# EAGLE design WorldClock (EAGLE 9.3.1)
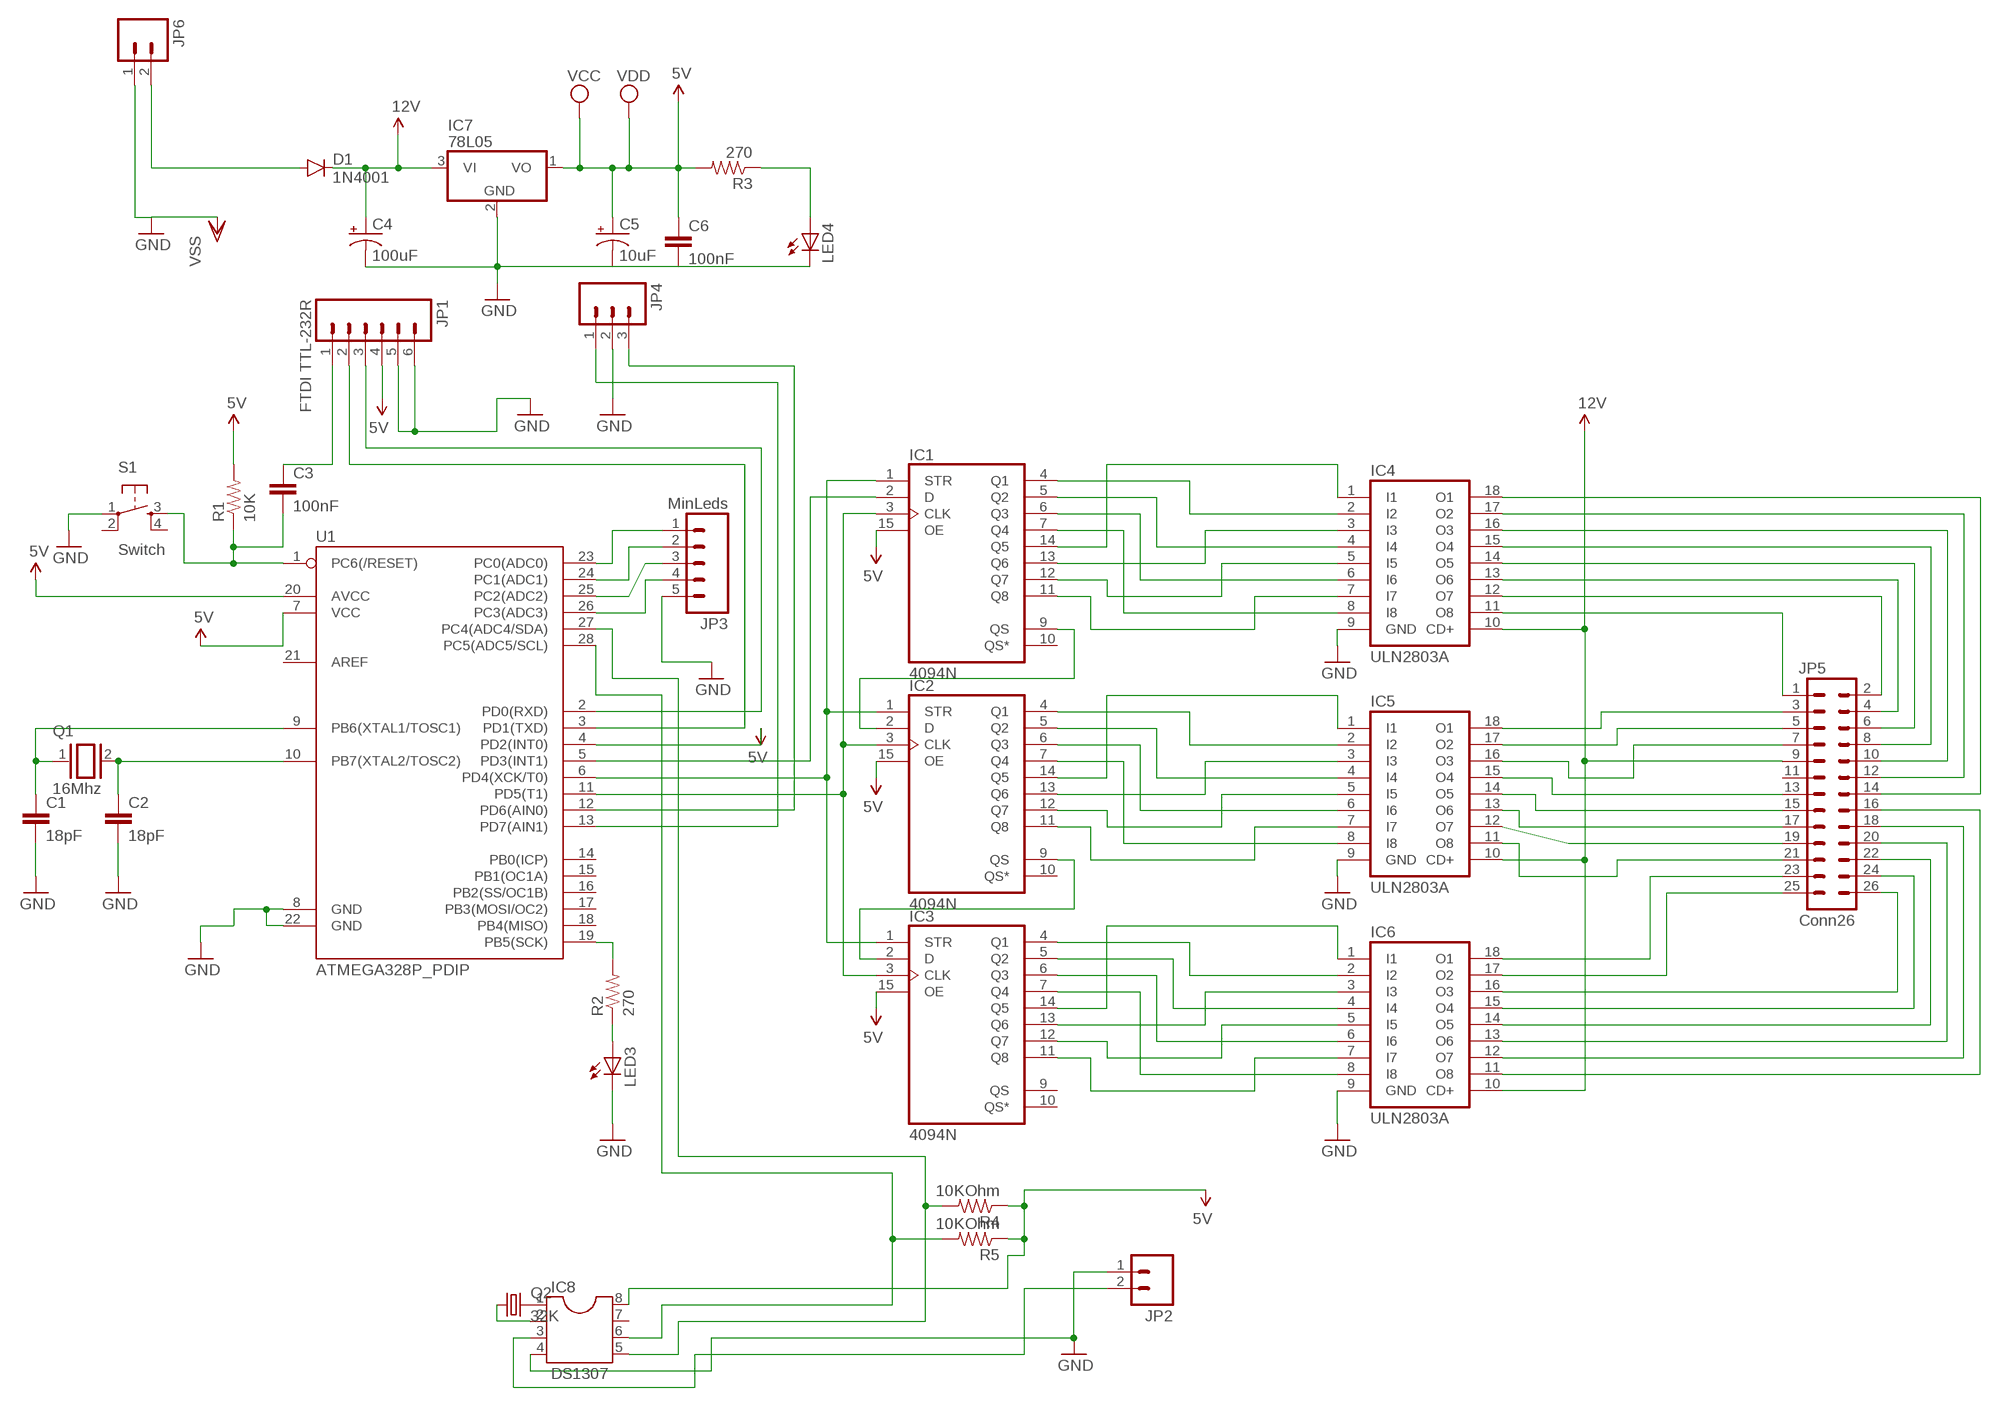
[diagram p0: schematic, sheet 1]

## Parts
C1  18pF  CAPPTH2  [CAP-PTH-SMALL2]
C2  18pF  CAPPTH2  [CAP-PTH-SMALL2]
C3  100nF  CAPPTH2  [CAP-PTH-SMALL2]
C4  100uF  CAP_POLPTH1  [CPOL-RADIAL-100UF-25V]
C5  10uF  CAP_POLPTH2  [CPOL-RADIAL-10UF-25V]
C6  100nF  CAPPTH2  [CAP-PTH-SMALL2]
D1  1N4001  DIODE1N4148  [DIODE-1N4148]
IC1  4094N  [DIL16]
IC2  4094N  [DIL16]
IC3  4094N  [DIL16]
IC4  ULN2803A  [DIL18]
IC5  ULN2803A  [DIL18]
IC6  ULN2803A  [DIL18]
IC7  78L05  78L12Z  [TO92]
IC8  DS1307  DIL8S  [SOCKET-08]
JP1  FTDI TTL-232R  M06NO_SILK_FEMALE_PTH  [1X06_NO_SILK]
JP2  M025MM  [SCREWTERMINAL-5MM-2]
JP3  MinLeds  M05PTH  [1X05]
JP4  M03-SCREW-5MM  [SCREWTERMINAL-5MM-3]
JP5  Conn26  M13X22X13  [2X13]
JP6  M025MM  [SCREWTERMINAL-5MM-2]
LED3  LED5MM  [LED5MM]
LED4  LED5MM  [LED5MM]
Q1  16Mhz  XTAL/S  [QS]
Q2  32K  CRYSTALTC26V  [TC26V]
R1  10K  RESISTORPTH-1/4W  [AXIAL-0.4]
R2  270  RESISTORPTH-1/4W  [AXIAL-0.4]
R3  270  RESISTORPTH-1/4W  [AXIAL-0.4]
R4  10KOhm  RESISTORPTH-1/4W  [AXIAL-0.4]
R5  10KOhm  RESISTORPTH-1/4W  [AXIAL-0.4]
S1  Switch  TAC_SWITCHPTH  [TACTILE-PTH]
U1  ATMEGA328P_PDIP  [DIL28-3]

## Nets
5V: C5.1(+) C6.1 IC1.15(OE) IC2.15(OE) IC3.15(OE) IC7.1(VO) IC8.8 JP1.4 R1.P$2 R3.P$2 R4.P$1 R5.P$1 U1.4(PD2(INT0)) U1.7(VCC) U1.20(AVCC) ; supply symbol labelled VCC, VDD
12V: C4.1(+) D1.C IC4.10(CD+) IC5.10(CD+) IC6.10(CD+) IC7.3(VI) JP5.9
GND: C1.2 C2.2 C4.2(-) C5.2(-) C6.2 IC4.9(GND) IC5.9(GND) IC6.9(GND) IC7.2(GND) IC8.4 JP1.5 JP1.6 JP2.1 JP3.5 JP4.2 JP6.1 LED3.K(C) LED4.K(C) S1.1 U1.8(GND) U1.22(GND) ; supply symbol labelled VSS
N$1: C1.1 Q1.1 U1.9(PB6(XTAL1/TOSC1))
N$2: C2.1 Q1.2 U1.10(PB7(XTAL2/TOSC2))
N$3: C3.2 R1.P$1 S1.3 U1.1(PC6(/RESET))
N$4: C3.1 JP1.1
N$5: JP4.1 U1.13(PD7(AIN1))
N$6: JP1.2 U1.3(PD1(TXD))
N$7: JP1.3 U1.2(PD0(RXD))
N$8: JP4.3 U1.12(PD6(AIN0))
N$9: JP3.1 U1.23(PC0(ADC0))
N$10: JP3.2 U1.24(PC1(ADC1))
N$11: JP3.3 U1.25(PC2(ADC2))
N$12: JP3.4 U1.26(PC3(ADC3))
N$13: R2.P$2 U1.19(PB5(SCK))
N$14: LED3.A R2.P$1
N$15: IC1.4(Q1) IC4.2(I2)
N$16: IC1.5(Q2) IC4.4(I4)
N$17: IC1.6(Q3) IC4.6(I6)
N$18: IC1.7(Q4) IC4.8(I8)
N$19: IC1.14(Q5) IC4.1(I1)
N$20: IC1.13(Q6) IC4.3(I3)
N$21: IC1.12(Q7) IC4.5(I5)
N$22: IC1.11(Q8) IC4.7(I7)
N$23: IC1.9(QS) IC2.2(D)
N$24: IC2.4(Q1) IC5.2(I2)
N$25: IC2.5(Q2) IC5.4(I4)
N$26: IC2.6(Q3) IC5.6(I6)
N$27: IC2.7(Q4) IC5.8(I8)
N$28: IC2.14(Q5) IC5.1(I1)
N$29: IC2.13(Q6) IC5.3(I3)
N$30: IC2.12(Q7) IC5.5(I5)
N$31: IC2.11(Q8) IC5.7(I7)
N$32: IC2.9(QS) IC3.2(D)
N$33: IC3.4(Q1) IC6.2(I2)
N$34: IC3.5(Q2) IC6.4(I4)
N$35: IC3.6(Q3) IC6.6(I6)
N$36: IC3.7(Q4) IC6.8(I8)
N$37: IC3.14(Q5) IC6.1(I1)
N$38: IC3.13(Q6) IC6.3(I3)
N$39: IC3.12(Q7) IC6.5(I5)
N$40: IC3.11(Q8) IC6.7(I7)
N$41: IC1.2(D) U1.5(PD3(INT1))
N$42: IC1.1(STR) IC2.1(STR) IC3.1(STR) U1.6(PD4(XCK/T0))
N$43: IC1.3(CLK) IC2.3(CLK) IC3.3(CLK) U1.11(PD5(T1))
N$44: IC5.14(O5) JP5.15
N$45: LED4.A R3.P$1
N$46: IC5.13(O6) JP5.17
N$47: IC4.11(O8) JP5.1
N$48: D1.A JP6.2
N$49: IC4.12(O7) JP5.2
N$50: IC4.13(O6) JP5.4
N$51: IC4.14(O5) JP5.6
N$52: IC4.15(O4) JP5.8
N$53: IC4.16(O3) JP5.10
N$54: IC4.17(O2) JP5.12
N$55: IC4.18(O1) JP5.14
N$56: IC5.18(O1) JP5.3
N$57: IC5.17(O2) JP5.5
N$58: IC5.16(O3) JP5.7
N$59: IC5.15(O4) JP5.13
N$60: IC5.12(O7) JP5.19
N$61: IC6.18(O1) JP5.23
N$62: IC5.11(O8) JP5.21
N$63: IC6.17(O2) JP5.25
N$64: IC6.16(O3) JP5.26
N$65: IC6.15(O4) JP5.24
N$66: IC6.14(O5) JP5.22
N$67: IC6.13(O6) JP5.20
N$68: IC6.12(O7) JP5.18
N$69: IC6.11(O8) JP5.16
N$70: IC8.6 R5.P$2 U1.28(PC5(ADC5/SCL))
N$71: IC8.3 JP2.2
N$72: IC8.5 R4.P$2 U1.27(PC4(ADC4/SDA))
N$73: IC8.1 Q2.2
N$74: IC8.2 Q2.1
Unconnected: IC1.10(QS*) IC2.10(QS*) IC3.9(QS) IC3.10(QS*) IC8.7 JP5.11 S1.2 S1.4 U1.14(PB0(ICP)) U1.15(PB1(OC1A)) U1.16(PB2(SS/OC1B)) U1.17(PB3(MOSI/OC2)) U1.18(PB4(MISO)) U1.21(AREF)

## Power pins joined to a net without a drawn wire
5V: IC1.16(VDD) IC2.16(VDD) IC3.16(VDD)
GND: IC1.8(VSS) IC2.8(VSS) IC3.8(VSS)

## Library data of the parts
C1-C3 C6 = SparkFun-Passives:CAP: Capacitor Standard 0603 ceramic capacitor, and 0.1" leaded capacitor.
C4 C5 = SparkFun-Capacitors:CAP_POL: Capacitor Polarized These are standard SMD and PTH capacitors. Normally 10uF, 47uF, and 100uF in electrolytic and tantalum varieties. Always verify the external diameter of the through hole cap, it varies with capacity, voltage, and manufacturer. The EIA devices should be standard.
D1 = SparkFun-DiscreteSemi:DIODE: Diode These are standard reverse protection diodes and small signal diodes. SMA package can handle up to about 1A. SOD-323 can handle about 200mA. What the SOD-323 package when ordering, there are some mfgs out there that are 5-pin packages.
IC1-IC3 = 40xx:4094: 8-stage SHIFT/STORE REGISTER, tri-state
IC4-IC6 = uln-udn:ULN2803A: DRIVER ARRAY
IC7 = linear:78*: Positive VOLTAGE REGULATOR Source: http://cache.national.com/ds/LM/LM78L05.pdf http://www.fairchildsemi.com/ds/LM/LM7805.pdf
IC8 = ic-package:DIL8: Dual In Line / Socket
JP1 = SparkFun-Connectors:M06: Header 6 Standard 6-pin 0.1" header. Use with straight break away headers (SKU : PRT-00116), right angle break away headers (PRT-00553), swiss pins (PRT-00743), machine pins (PRT-00117), and female headers (PRT-00115). Molex polarized connector foot print use with SKU : PRT-08094 with associated crimp pins and housings. NOTES ON THE VARIANTS LOCK and LOCK_LONGPADS... This footprint was designed to help hold the alignment of a through-hole component (i.e. 6-pin header) while soldering it into place. You may notice that each hole has been shifted either up or down by 0.005 of an inch from it's more standard position (which is a perfectly straight line). This slight alteration caused the pins (the squares in the middle) to touch the edges of the holes. Because they are alternating, it causes a "brace" to hold the component in place. 0.005 has proven to be the perfect amount of "off-center" position when using our standard breakaway headers. Although looks a little odd when you look at the bare footprint, once you have a header in there, the alteration is very hard to notice. Also,if you push a header all the way into place, it is covered up entirely on the bottom side. This idea of altering the position of holes to aid alignment will be further integrated into the Sparkfun Library for other footprints. It can help hold any component with 3 or more connection pins.; PROD_ID: CONN-08437
JP2 JP6 = SparkFun-Connectors:M02: Standard 2-pin 0.1" header. Use with - straight break away headers ( PRT-00116) - right angle break away headers (PRT-00553) - swiss pins (PRT-00743) - machine pins (PRT-00117) - female headers (PRT-00115) Molex polarized connector foot print use with: PRT-08233 with associated crimp pins and housings. 2.54_SCREWTERM for use with PRT-10571. 3.5mm Screw Terminal footprints for PRT-08084 5mm Screw Terminal footprints for use with PRT-08432; STOREFRONT_ID: PRT-08432
JP3 = SparkFun-Connectors:M05: Header 5 Standard 5-pin 0.1" header. Use with straight break away headers (SKU : PRT-00116), right angle break away headers (PRT-00553), swiss pins (PRT-00743), machine pins (PRT-00117), and female headers (PRT-00115). Molex polarized connector foot print use with SKU : PRT-08230 with associated crimp pins and housings.
JP4 = SparkFun-Connectors:M03: Header 3 Standard 3-pin 0.1" header. Use with straight break away headers (SKU : PRT-00116), right angle break away headers (PRT-00553), swiss pins (PRT-00743), machine pins (PRT-00117), and female headers (PRT-00115). Molex polarized connector foot print use with SKU : PRT-08232 with associated crimp pins and housings.; STOREFRONT_ID: PRT-08433
JP5 = SparkFun-Connectors:M13X2: 0.1" spaced headers
LED3 LED4 = led:LED: LED OSRAM: - CHIPLED LG R971, LG N971, LY N971, LG Q971, LY Q971, LO R971, LY R971 LH N974, LH R974 LS Q976, LO Q976, LY Q976 LO Q996 - Hyper CHIPLED LW Q18S LB Q993, LB Q99A, LB R99A - SideLED LS A670, LO A670, LY A670, LG A670, LP A670 LB A673, LV A673, LT A673, LW A673 LH A674 LY A675 LS A676, LA A676, LO A676, LY A676, LW A676 LS A679, LY A679, LG A679 - Hyper Micro SIDELED® LS Y876, LA Y876, LO Y876, LY Y876 LT Y87S - SmartLED LW L88C, LW L88S LB L89C, LB L89S, LG L890 LS L89K, LO L89K, LY L89K LS L896, LA L896, LO L896, LY L896 - TOPLED LS T670, LO T670, LY T670, LG T670, LP T670 LSG T670, LSP T670, LSY T670, LOP T670, LYG T670 LG T671, LOG T671, LSG T671 LB T673, LV T673, LT T673, LW T673 LH T674 LS T676, LA T676, LO T676, LY T676, LB T676, LH T676, LSB T676, LW T676 LB T67C, LV T67C, LT T67C, LS T67K, LO T67K, LY T67K, LW E67C LS E67B, LA E67B, LO E67B, LY E67B, LB E67C, LV E67C, LT E67C LW T67C LS T679, LY T679, LG T679 LS T770, LO T770, LY T770, LG T770, LP T770 LB T773, LV T773, LT T773, LW T773 LH T774 LS E675, LA E675, LY E675, LS T675 LS T776, LA T776, LO T776, LY T776, LB T776 LHGB T686 LT T68C, LB T68C - Hyper Mini TOPLED® LB M676 - Mini TOPLED Santana® LG M470 LS M47K, LO M47K, LY M47K Source: http://www.osram.convergy.de LUXEON: - LUMILED® LXK2-PW12-R00, LXK2-PW12-S00, LXK2-PW14-U00, LXK2-PW14-V00 LXK2-PM12-R00, LXK2-PM12-S00, LXK2-PM14-U00 LXK2-PE12-Q00, LXK2-PE12-R00, LXK2-PE12-S00, LXK2-PE14-T00, LXK2-PE14-U00 LXK2-PB12-K00, LXK2-PB12-L00, LXK2-PB12-M00, LXK2-PB14-N00, LXK2-PB14-P00, LXK2-PB14-Q00 LXK2-PR12-L00, LXK2-PR12-M00, LXK2-PR14-Q00, LXK2-PR14-R00 LXK2-PD12-Q00, LXK2-PD12-R00, LXK2-PD12-S00 LXK2-PH12-R00, LXK2-PH12-S00 LXK2-PL12-P00, LXK2-PL12-Q00, LXK2-PL12-R00 Source: www.luxeon.com KINGBRIGHT: KA-3528ASYC Source: www.kingbright.com
Q1 = special:XTAL/S: CRYSTAL
Q2 = crystal:CRYSTAL: CRYSTAL; OC_FARNELL: unknown; OC_NEWARK: unknown
R1-R5 = SparkFun-Passives:RESISTOR: Resistor Basic schematic elements and footprints for 0603, 1206, and PTH resistors.
S1 = SparkFun-Retired:TAC_SWITCH: Momentary Switch Button commonly used for reset or general input. Spark Fun Electronics SKU : COM-00097 SMT- SWCH-08247
U1 = SparkFun-DigitalIC:ATMEGA328P_PDIP: uC used in the Arduino 32kb flash, 1k EEPROM, 2k SRAM This is the through-hole version of this chip.

## Board
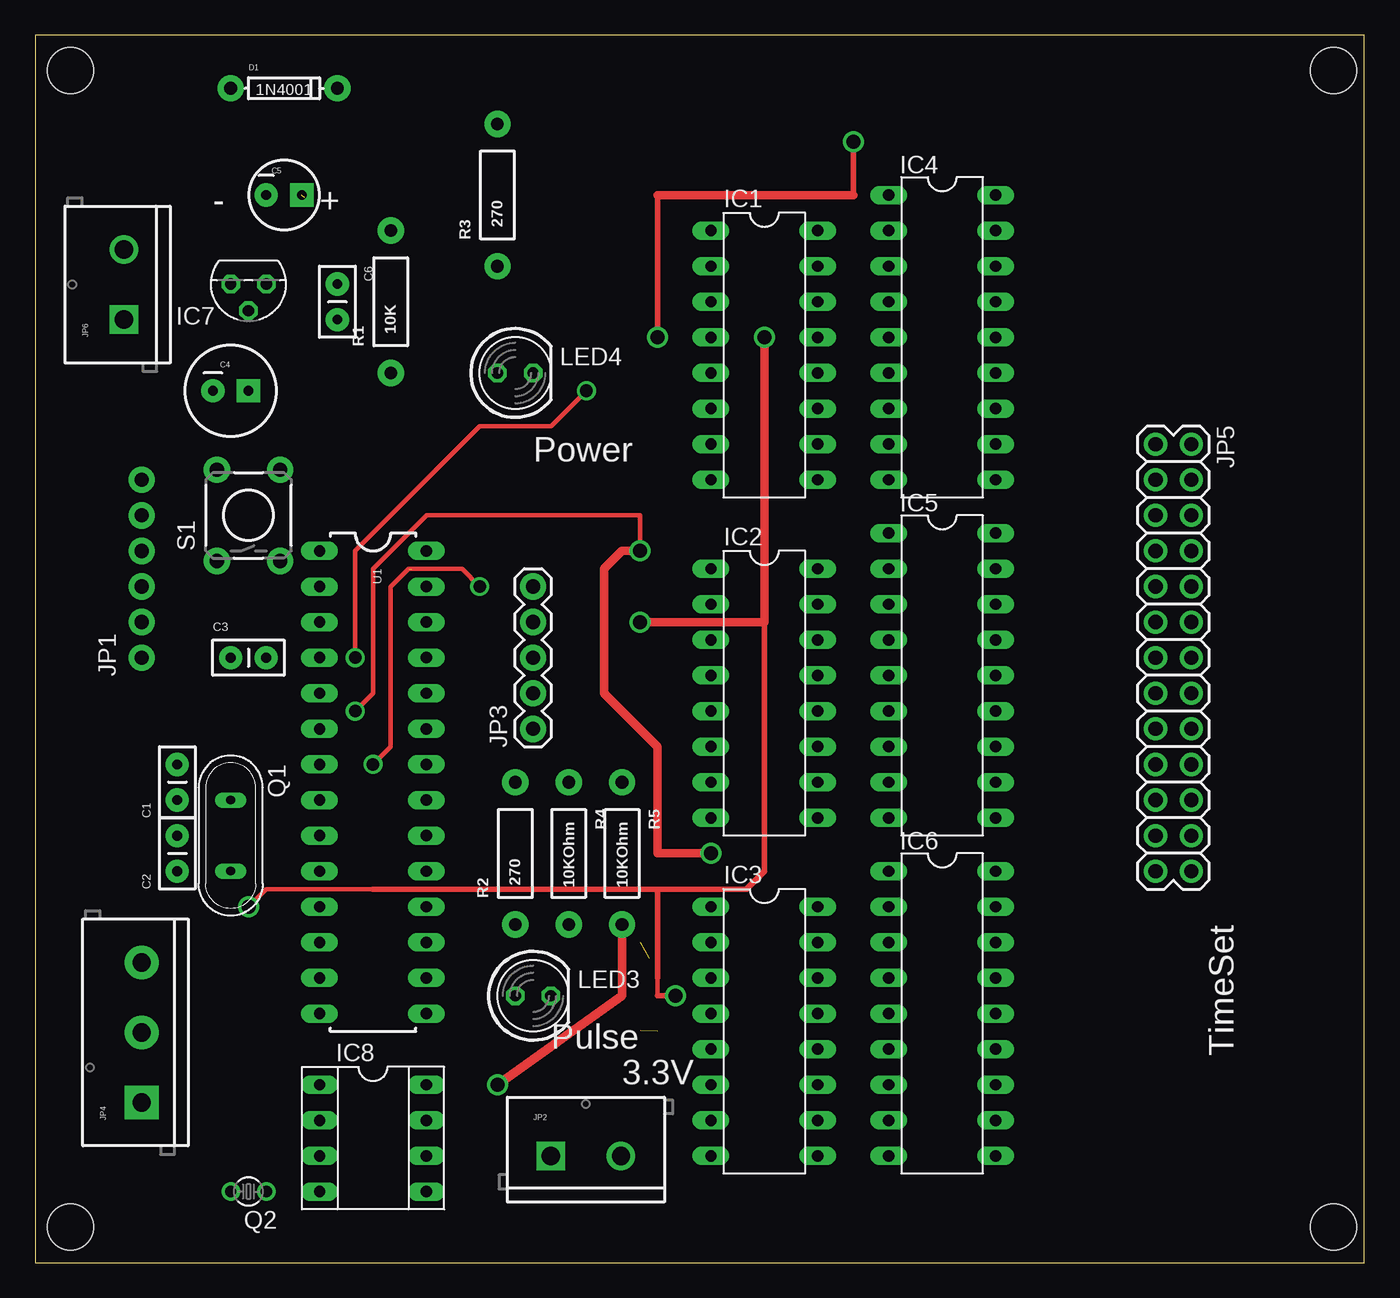
[diagram p1: board, top side]
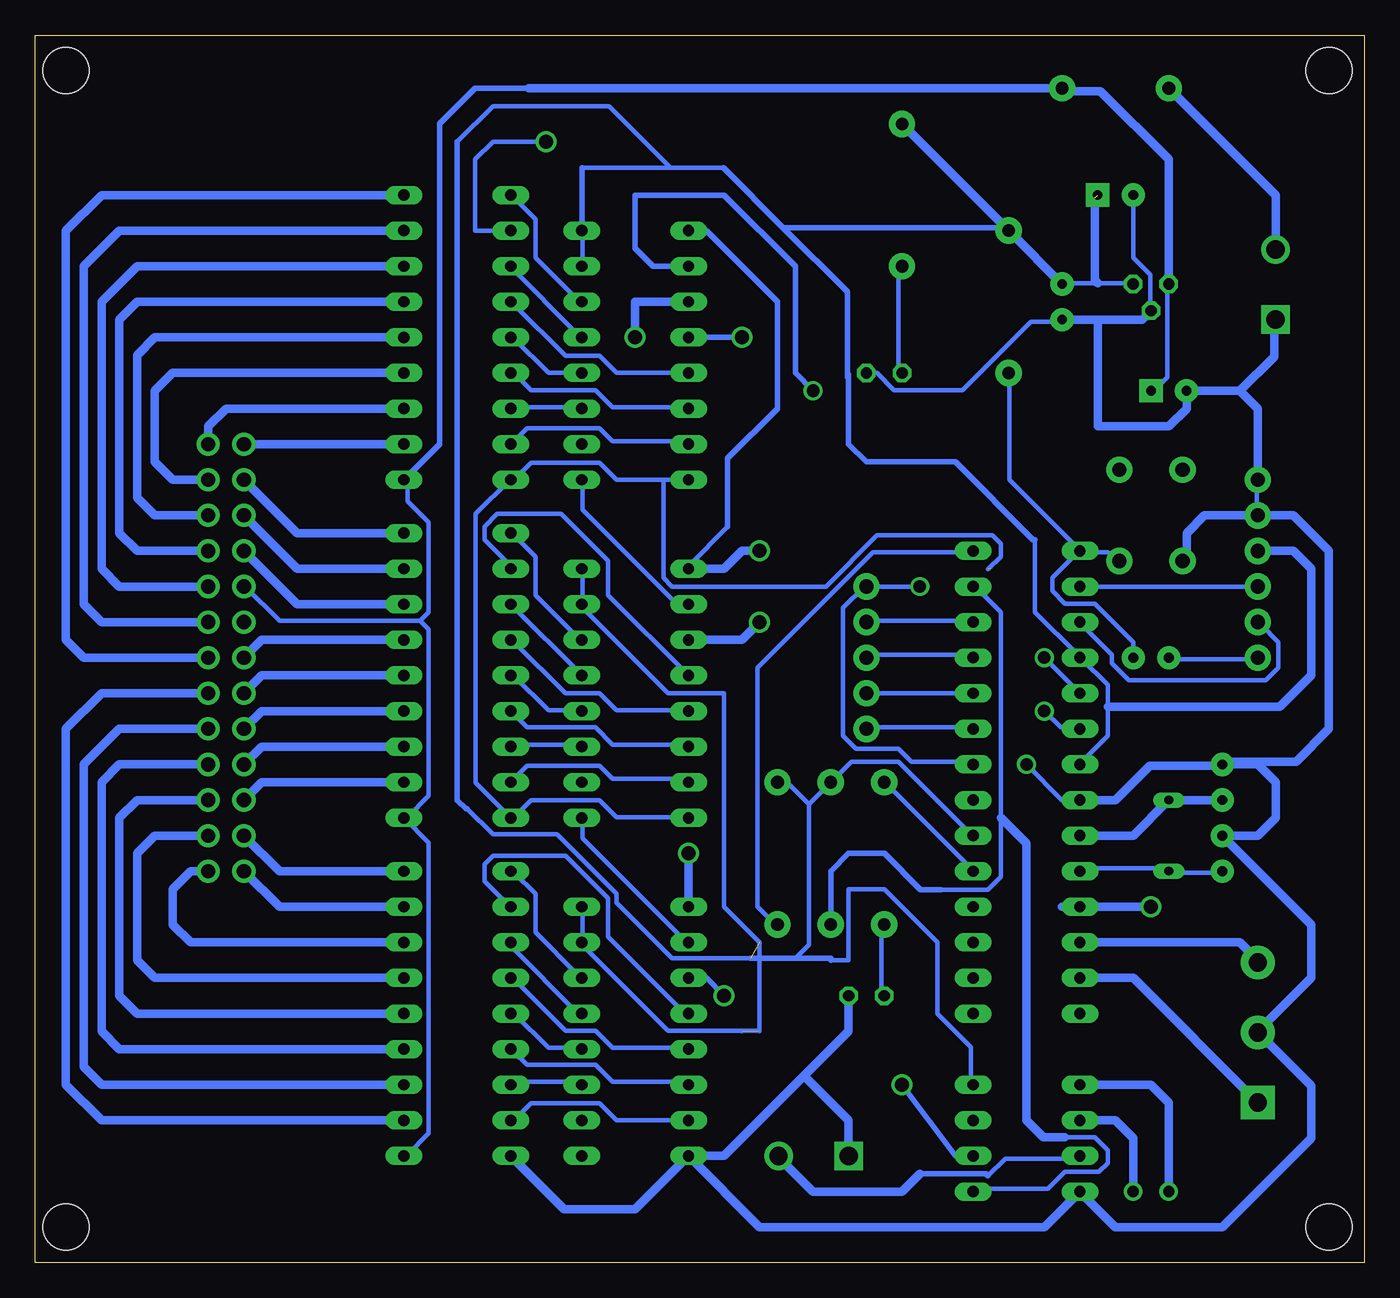
[diagram p2: board, bottom side, seen from below]

Size 94.92 x 87.62 mm. Coordinates in mm from the lower left corner, seen from the top.
Outline: 0,0 94.92,0 94.92,87.62 0,87.62 0,0
Copper layers (1*16): Top 0.035mm / dielectric 1.5mm / Bottom 0.035mm
Design rules "default *": minimum track width 12mil, minimum drill 28mil, track to track 12mil, track to pad 12mil, pad to pad 12mil, via to via 12mil, smd to smd 12mil, copper to edge 40mil, drill to drill 12mil, minimum pad ring 10mil, minimum via ring 8mil, stop-mask expansion 4mil, vias tented up to drill 0mil, thermal gap 10mil

### Footprints (pad centres in the part's own frame; a part is rotated, then mirrored left to right if it is on the bottom)
CAP-PTH-SMALL2 = drill 0.7 pad 1.651: 1 0,0; 2 2.54,0
CPOL-RADIAL-100UF-25V = drill 0.7 pad 1.651 square: 1 1.27,0 | drill 0.7 pad 1.651: 2 -1.27,0
CPOL-RADIAL-10UF-25V = drill 0.7 pad 1.651 square: 1 1.27,0 | drill 0.7 pad 1.651: 2 -1.27,0
DIODE-1N4148 = drill 0.9 pad 1.88: A -3.81,0; C 3.81,0
DIL16 = drill 0.813 long: 1 -8.89,-3.81; 2 -6.35,-3.81; 3 -3.81,-3.81; 4 -1.27,-3.81; 5 1.27,-3.81; 6 3.81,-3.81; 7 6.35,-3.81; 8 8.89,-3.81; 9 8.89,3.81; 10 6.35,3.81; 11 3.81,3.81; 12 1.27,3.81; 13 -1.27,3.81; 14 -3.81,3.81; 15 -6.35,3.81; 16 -8.89,3.81
DIL18 = drill 0.813 long: 1 -10.16,-3.81; 2 -7.62,-3.81; 3 -5.08,-3.81; 4 -2.54,-3.81; 5 0,-3.81; 6 2.54,-3.81; 7 5.08,-3.81; 8 7.62,-3.81; 9 10.16,-3.81; 10 10.16,3.81; 11 7.62,3.81; 12 5.08,3.81; 13 2.54,3.81; 14 0,3.81; 15 -2.54,3.81; 16 -5.08,3.81; 17 -7.62,3.81; 18 -10.16,3.81
TO92 = drill 0.813 octagon: 1 -1.27,0; 2 0,1.905; 3 1.27,0
SOCKET-08 = drill 0.813 long: 1 -3.81,-3.81; 2 -1.27,-3.81; 3 1.27,-3.81; 4 3.81,-3.81; 5 3.81,3.81; 6 1.27,3.81; 7 -1.27,3.81; 8 -3.81,3.81
1X06_NO_SILK = drill 1.016 pad 1.88: 1 0,0; 2 2.54,0; 3 5.08,0; 4 7.62,0; 5 10.16,0; 6 12.7,0
SCREWTERMINAL-5MM-2 = drill 1.3 pad 2.032 square: 1 0,0 | drill 1.3 pad 2.032: 2 5,0
1X05 = drill 1.016 pad 1.88: 1 0,0; 2 2.54,0; 3 5.08,0; 4 7.62,0; 5 10.16,0
SCREWTERMINAL-5MM-3 = drill 1.3 pad 2.413 square: 1 0,0 | drill 1.3 pad 2.413: 2 5,0; 3 10,0
2X13 = drill 1.016 pad 1.651: 1 0,0; 2 0,2.54; 3 2.54,0; 4 2.54,2.54; 5 5.08,0; 6 5.08,2.54; 7 7.62,0; 8 7.62,2.54; 9 10.16,0; 10 10.16,2.54; 11 12.7,0; 12 12.7,2.54; 13 15.24,0; 14 15.24,2.54; 15 17.78,0; 16 17.78,2.54; 17 20.32,0; 18 20.32,2.54; 19 22.86,0; 20 22.86,2.54; 21 25.4,0; 22 25.4,2.54; 23 27.94,0; 24 27.94,2.54; 25 30.48,0; 26 30.48,2.54
LED5MM = drill 0.813 octagon: A -1.27,0; K 1.27,0
QS = drill 0.61 long: 1 -2.54,0; 2 2.54,0
TC26V = drill 0.813: 1 -1.27,0; 2 1.27,0
AXIAL-0.4 = drill 0.9 pad 1.88: P$1 -5.08,0; P$2 5.08,0
TACTILE-PTH = drill 1.016 pad 1.88: 1 -3.251,2.261; 2 3.251,2.261; 3 -3.251,-2.261; 4 3.251,-2.261
DIL28-3 = drill 0.813 long: 1 -16.51,-3.81; 2 -13.97,-3.81; 3 -11.43,-3.81; 4 -8.89,-3.81; 5 -6.35,-3.81; 6 -3.81,-3.81; 7 -1.27,-3.81; 8 1.27,-3.81; 9 3.81,-3.81; 10 6.35,-3.81; 11 8.89,-3.81; 12 11.43,-3.81; 13 13.97,-3.81; 14 16.51,-3.81; 15 16.51,3.81; 16 13.97,3.81; 17 11.43,3.81; 18 8.89,3.81; 19 6.35,3.81; 20 3.81,3.81; 21 1.27,3.81; 22 -1.27,3.81; 23 -3.81,3.81; 24 -6.35,3.81; 25 -8.89,3.81; 26 -11.43,3.81; 27 -13.97,3.81; 28 -16.51,3.81
STAND-OFF = hole 3.302: 0,0

### Placement (x,y rotation side)
C1  10.16,33.02 90 top
C2  10.16,27.94 90 top
C3  13.97,43.18 0 top
C4  13.97,62.23 0 top
C5  17.78,76.2 0 top
C6  21.59,69.85 270 top
D1  17.78,83.82 0 top
IC1  52.07,64.77 270 top
IC2  52.07,40.64 270 top
IC3  52.07,16.51 270 top
IC4  64.77,66.04 270 top
IC5  64.77,41.91 270 top
IC6  64.77,17.78 270 top
IC7  15.24,69.85 180 top
IC8  24.13,8.89 270 top
JP1  7.62,43.18 90 top
JP2  36.83,7.62 0 top
JP3  35.56,38.1 90 top
JP4  7.62,11.43 90 top
JP5  80.01,58.42 270 top
JP6  6.35,67.31 90 top
LED3  35.56,19.05 0 top
LED4  34.29,63.5 0 top
Q1  13.97,30.48 270 top
Q2  15.24,5.08 180 top
R1  25.4,68.58 90 top
R2  34.29,29.21 90 top
R3  33.02,76.2 90 top
R4  38.1,29.21 270 top
R5  41.91,29.21 270 top
S1  15.24,53.34 90 top
U1  24.13,34.29 270 top
U$1  [STAND-OFF]  2.54,85.09 0 top
U$2  [STAND-OFF]  2.54,2.54 0 top
U$3  [STAND-OFF]  92.71,2.54 0 top
U$4  [STAND-OFF]  92.71,85.09 0 top

### Tracks (layer width: path | path; a pad name or v marks a point on that pad's centre or on a via)
5V  (3 unrouted)
  Bottom 0.305: 39.68,32.72 39.68,22.71 40.64,21.74 | 39.68,32.72 R4.P$1 36.63,35.76 33.27,35.76 28.09,30.58 U1.20 | IC8.8 28.09,12.9 28.09,15.39 30.48,17.78 30.48,22.86 34.29,26.67 36.83,26.67 36.83,21.59 38.1,21.59 | 39.68,32.72 41.2,34.24 41.81,34.24 R5.P$1 | IC3.16 55.83,25.4 55.83,22.96 IC3.15 55.83,22.66 49.73,16.56 43.23,16.56 43.18,16.51 43.18,22.86 45.72,25.4 45.72,40.64 49.73,40.64 55.83,46.74 IC2.15 55.83,47.04 55.83,49.48 IC2.16 | U1.7 20.17,35.76 18.34,37.59 18.34,39.67 18.34,41.25 20.17,43.08 U1.4 20.47,43.38 23.52,46.43 23.52,51.61 | IC7.1 16.51,69.9 19.05,69.9 21.39,69.9 C6.1 21.69,69.9 | 25.35,73.56 R1.P$2 25.65,73.86 | 32.97,81.18 R3.P$2 | 43.84,21.74 49.43,21.74 53.39,25.7 53.39,26.31 57.66,30.58 62.23,30.58 64.06,32.41 | 45.77,78.13 49.53,78.13 | 49.53,78.13 55.88,78.13 | IC1.15 55.83,71.12 55.83,73.56 IC1.16 | 44.5,16.56 44.45,16.51 | 64.77,69.85 64.77,80.01 62.23,82.55 53.95,82.55 49.53,78.13
  Bottom 0.406: IC1.16 55.88,78.13 | 43.84,21.74 40.64,21.74 38.1,21.74 38.1,21.59 | 36.93,63.5 36.93,63.2 36.83,63.09 | 36.93,63.5 36.93,69.29 41.5,73.86 | 41.5,73.86 45.77,78.13 | 25.65,73.86 41.5,73.86 | 64.06,32.41 64.16,32.41 64.77,33.02 64.77,80.01 | 23.52,51.61 23.67,51.61 29.21,57.15 35.56,57.15 36.83,58.42 36.83,63.4 36.93,63.5
  Bottom 0.61: 32.97,81.18 32.92,81.18 R1.P$2 | 25.35,73.56 25.3,73.56 C6.1 | 19.25,76 19.25,70.1 19.05,69.9 | 18.34,39.67 6.04,39.67 3.81,41.91 3.81,49.53 5.08,50.8 JP1.4
12V
  Bottom 0.305: C4.1 14.99,62.28 14.07,63.2 14.07,69.6 IC7.3 14.07,69.9 | 21.39,83.62 D1.C 21.69,83.62 | 67.41,45.82 66.8,46.43 66.8,52.83 68.33,54.36 68.33,55.88 IC4.10 | 67.41,45.82 77.47,45.82 79.91,48.26 JP5.9 | IC6.10 68.33,7.72 66.8,9.25 66.8,29.97 IC5.10 68.33,31.8 66.8,33.33 66.8,45.21 67.41,45.82
  Bottom 0.406: 68.33,55.88 68.33,56.13 66.04,58.42 66.04,81.28 63.5,83.82 59.69,83.82
  Bottom 0.61: 59.69,83.82 D1.C | 21.39,83.62 18.85,83.62 13.97,78.74 IC7.3
GND  (via drill 0.9 pad 0.81)  (1 unrouted)
  Top 0.305: v24.13,35.56 25.4,36.83 25.4,48.26 26.67,49.53 30.48,49.53 v31.75,48.26
  Bottom 0.305: JP1.5 7.67,53.44 7.67,55.88 JP1.6 | 12.55,62.28 C4.2 | 6.45,67.16 JP6.1 | LED4.K 34.8,63.5 33.58,62.28 28.7,62.28 23.82,67.16 21.69,67.16 C6.2 21.39,67.46 | C5.2 16.51,71.73 15.29,70.51 15.29,68.07 IC7.2 | 48.51,7.42 IC3.8 | IC2.8 48.51,31.8 53.39,31.8 54.61,33.02 59.49,33.02 60.71,31.8 IC5.9 63.45,34.24 63.45,53.44 61.01,55.88 IC4.9 60.71,55.88 59.49,57.1 54.61,57.1 53.39,55.88 50.04,55.88 | 50.04,55.88 IC1.8 | U1.22 28.09,35.76 32.36,35.76 33.27,36.68 36.32,36.68 37.24,37.59 37.24,46.74 35.71,48.26 JP3.5 v31.75,48.26 | 10.41,35.46 C1.2 10.11,35.76 | 50.04,55.88 50.04,48.87 49.43,48.26 38.46,48.26 34.8,51.92 26.57,51.92 25.96,51.31 25.96,50.39 26.87,49.48 | U1.8 21.59,33.02 v24.13,35.56
  Bottom 0.61: 48.51,7.42 48.51,7.37 52.07,3.81 57.15,3.81 IC6.9 | C1.2 7.62,35.56 6.35,34.29 6.35,31.75 7.62,30.48 C2.2 3.81,24.13 3.81,20.32 7.62,16.51 JP4.2 3.81,12.62 3.81,8.89 10.16,2.54 17.78,2.54 IC8.4 22.86,2.54 43.18,2.54 IC3.8 45.72,7.62 40.01,13.34 | 10.11,35.76 4.88,35.76 2.54,38.1 2.54,50.8 5.08,53.34 JP1.5 11.43,53.34 12.7,52.07 12.7,50.37 S1.1 | 6.45,67.16 6.45,64.67 8.89,62.23 | 8.89,62.23 C4.2 12.7,60.96 13.97,59.69 19.05,59.69 19.05,67.31 | JP1.6 7.62,60.96 8.89,62.23 | 19.05,67.31 15.88,67.31 IC7.2 | 21.39,67.46 21.44,67.46 C6.2 19.05,67.31 | LED3.K 36.83,16.51 40.01,13.34 | JP2.1 36.83,10.16 40.01,13.34 | 10.41,35.46 15.34,35.46 17.78,33.02 U1.8
N$1
  Bottom 0.305: 20.17,30.58 U1.9 | 14.07,33.02 Q1.1
  Bottom 0.61: 14.07,33.02 14.07,32.92 16.51,30.48 U1.9 | Q1.1 C1.1
N$2
  Bottom 0.305: C2.1 10.41,27.84 13.77,27.84 Q1.2 14.07,28.14 20.17,28.14 U1.10
N$3
  Bottom 0.305: U1.1 20.17,50.7 18.34,50.7 17.73,50.09 S1.3 | C3.2 16.51,44.3 19.25,47.04 21.39,47.04 22.3,47.95 22.3,48.87 20.47,50.7 U1.1 | R1.P$1 25.35,63.5 25.35,55.88 20.47,51 U1.1
N$4
  Bottom 0.305: C3.1 13.77,43.08 7.67,43.08 JP1.1
N$5
  Bottom 0.61: JP4.1 16.51,20.32 U1.13
N$6
  Bottom 0.305: U1.3 20.17,45.52 18.03,43.38 18.03,42.77 16.82,41.55 7.06,41.55 6.15,42.47 6.15,44.3 7.37,45.52 JP1.2
N$7
  Bottom 0.305: JP1.3 U1.2
N$8
  Bottom 0.61: JP4.3 7.62,21.59 8.89,22.86 U1.12
N$9
  Bottom 0.305: U1.23 28.09,38.2 35.41,38.2 JP3.1
N$10
  Bottom 0.305: JP3.2 U1.24
N$11
  Bottom 0.305: U1.25 28.09,43.38 35.41,43.38 JP3.3
N$12
  Bottom 0.305: U1.26 28.09,45.82 35.41,45.82 JP3.4
N$13
  Bottom 0.305: U1.19 28.09,28.14 34.19,34.24 R2.P$2
N$14
  Bottom 0.305: LED3.A 34.49,19.3 34.49,23.88 R2.P$1
N$15  (via drill 1 pad 0.81)
  Top 0.406: v44.45,66.04 44.45,76.2 | v58.42,80.01 58.42,76.2
  Top 0.61: 44.45,76.2 58.42,76.2
  Bottom 0.305: 61.01,73.86 IC4.2 63.5,73.66 63.5,78.74 62.23,80.01 v58.42,80.01
  Bottom 0.406: IC1.4 v44.45,66.04
N$16
  Bottom 0.305: IC1.5 53.39,63.5 54.61,64.72 57.05,64.72 60.71,68.38 IC4.4
N$17
  Bottom 0.305: IC1.6 48.51,61.06 53.7,61.06 54.92,62.28 59.49,62.28 60.71,63.5 IC4.6
N$18
  Bottom 0.305: IC1.7 48.51,58.62 53.7,58.62 54.61,59.54 59.79,59.54 60.71,58.62 IC4.8
N$19
  Bottom 0.305: IC1.14 56.13,68.68 59.18,71.73 59.18,74.47 60.71,76 IC4.1
N$20
  Bottom 0.305: IC1.13 56.13,66.24 61.01,71.12 IC4.3
N$21
  Bottom 0.305: IC1.12 58.27,63.5 60.71,65.94 IC4.5
N$22
  Bottom 0.305: IC1.11 56.13,61.06 60.71,61.06 IC4.7
N$23
  Bottom 0.305: IC2.2 48.51,47.04 49.12,47.04 55.83,53.75 55.83,55.88 IC1.9
N$24
  Bottom 0.305: IC2.4 54,47.65 54,50.09 57.35,53.44 61.93,53.44 62.84,52.53 62.84,51.61 61.01,49.78 IC5.2
N$25
  Bottom 0.305: IC2.5 48.51,39.42 53.39,39.42 54.61,40.64 57.05,40.64 60.71,44.3 IC5.4
N$26
  Bottom 0.305: IC5.6 59.79,38.2 54.92,38.2 53.7,36.98 48.51,36.98 IC2.6
N$27
  Bottom 0.305: IC5.8 59.79,35.46 54.61,35.46 53.7,34.54 48.51,34.54 IC2.7
N$28
  Bottom 0.305: IC2.14 56.13,44.6 59.18,47.65 59.18,50.39 60.71,51.92 IC5.1
N$29
  Bottom 0.305: IC5.3 IC2.13
N$30
  Bottom 0.305: IC2.12 56.13,39.42 58.27,39.42 60.71,41.86 IC5.5
N$31
  Bottom 0.305: IC2.11 56.13,36.98 60.71,36.98 IC5.7
N$32
  Bottom 0.305: IC3.2 48.51,22.96 55.83,30.28 55.83,31.5 IC2.9
N$33
  Bottom 0.305: IC3.4 48.51,17.78 54,23.27 54,26.01 57.05,29.06 62.23,29.06 62.84,28.45 62.84,27.23 61.01,25.4 IC6.2
N$34
  Bottom 0.305: IC3.5 48.51,15.34 53.7,15.34 54.92,16.56 57.05,16.56 60.71,20.22 IC6.4
N$35
  Bottom 0.305: IC3.6 48.51,12.9 53.7,12.9 54.92,14.12 59.79,14.12 60.71,15.04 IC6.6
N$36
  Bottom 0.305: IC3.7 53.39,10.16 54.61,11.38 59.49,11.38 60.71,10.16 IC6.8
N$37
  Bottom 0.305: IC3.14 56.13,20.52 59.18,23.57 59.18,26.31 60.71,27.84 IC6.1
N$38
  Bottom 0.305: IC3.13 56.13,17.78 61.01,22.66 IC6.3
N$39
  Bottom 0.305: IC3.12 56.13,15.34 58.27,15.34 60.71,17.78 IC6.5
N$40
  Bottom 0.305: IC3.11 56.13,12.9 60.71,12.9 IC6.7
N$41  (via drill 0.9 pad 0.81)
  Top 0.305: v22.86,43.18 22.86,50.8 31.75,59.69 36.83,59.69 v39.37,62.23
  Bottom 0.305: U1.5 20.47,40.64 20.47,40.79 v22.86,43.18
  Bottom 0.406: IC1.2 50.8,71.12 52.07,72.39 52.07,76.2 45.72,76.2 40.64,71.12 40.64,63.5 v39.37,62.23
N$42  (via drill 0.9 pad 0.81, 1 pad 0.81)
  Top 0.305: v22.86,39.37 24.13,40.64 24.13,49.53 27.94,53.34 43.18,53.34 v43.18,50.8
  Top 0.61: v48.26,29.21 44.45,29.21 44.45,36.83 40.64,40.64 40.64,49.53 41.91,50.8 v43.18,50.8
  Bottom 0.305: 45.47,52.53 48.21,49.78 IC2.1 | U1.6 20.47,38.2 21.69,38.2 v22.86,39.37
  Bottom 0.406: 45.47,52.53 45.47,57.4 41.91,60.96 41.91,68.58 46.99,73.66 IC1.1
  Bottom 0.61: IC2.1 45.72,49.53 44.45,50.8 v43.18,50.8 | IC3.1 v48.26,29.21
N$43  (via drill 1 pad 0.81)
  Top 0.305: 44.45,19.05 44.45,21.59 | v15.24,25.4 16.51,26.67 25.4,26.67
  Top 0.406: 24.13,26.67 25.4,26.67 44.45,26.67 | 44.45,26.67 44.45,21.59 44.45,20.32 | 52.07,45.72 52.07,27.94 50.8,26.67 44.45,26.67 | v45.72,19.05 44.45,19.05
  Top 0.61: v52.07,66.04 52.07,45.72 v43.18,45.72
  Bottom 0.406: IC3.3 46.99,20.32 v45.72,19.05
  Bottom 0.61: IC1.3 52.07,68.58 v52.07,66.04 | 21.59,25.4 U1.11 v15.24,25.4 | IC2.3 44.45,44.45 v43.18,45.72
N$44
  Bottom 0.61: IC5.14 78.74,41.91 JP5.15
N$45
  Bottom 0.305: LED4.A 33.27,63.5 33.27,71.12 R3.P$1
N$46
  Bottom 0.61: IC5.13 78.74,39.37 JP5.17
N$47
  Bottom 0.61: IC4.11 JP5.1
N$48
  Bottom 0.61: JP6.2 6.35,76.2 D1.A
N$49
  Bottom 0.61: IC4.12 81.28,60.96 82.55,59.69 JP5.2
N$50
  Bottom 0.61: IC4.13 85.09,63.5 86.36,62.23 86.36,57.15 85.09,55.88 JP5.4
N$51
  Bottom 0.61: IC4.14 86.36,66.04 87.63,64.77 87.63,54.61 86.36,53.34 JP5.6
N$52
  Bottom 0.61: IC4.15 87.63,68.58 88.9,67.31 88.9,52.07 87.63,50.8 JP5.8
N$53
  Bottom 0.61: IC4.16 87.63,71.12 90.17,68.58 90.17,49.53 88.9,48.26 JP5.10
N$54
  Bottom 0.61: IC4.17 88.9,73.66 91.44,71.12 91.44,46.99 90.17,45.72 JP5.12
N$55
  Bottom 0.61: IC4.18 90.17,76.2 92.71,73.66 92.71,44.45 91.44,43.18 JP5.14
N$56
  Bottom 0.61: IC5.18 76.2,52.07 JP5.3
N$57
  Bottom 0.61: IC5.17 76.2,49.53 JP5.5
N$58
  Bottom 0.61: IC5.16 76.2,46.99 JP5.7
N$59
  Bottom 0.61: IC5.15 78.74,44.45 JP5.13
N$60
  Bottom 0.61: IC5.12 78.74,36.83 JP5.19
N$61
  Bottom 0.61: IC6.18 77.47,27.94 JP5.23
N$62
  Bottom 0.61: IC5.11 78.74,34.29 JP5.21
N$63
  Bottom 0.61: IC6.17 77.47,25.4 JP5.25
N$64
  Bottom 0.61: IC6.16 83.82,22.86 85.09,24.13 85.09,26.67 83.82,27.94 JP5.26
N$65
  Bottom 0.61: IC6.15 86.36,20.32 87.63,21.59 87.63,29.21 86.36,30.48 JP5.24
N$66
  Bottom 0.61: IC6.14 87.63,17.78 88.9,19.05 88.9,31.75 87.63,33.02 JP5.22
N$67
  Bottom 0.61: IC6.13 88.9,15.24 90.17,16.51 90.17,34.29 88.9,35.56 JP5.20
N$68
  Bottom 0.61: IC6.12 90.17,12.7 91.44,13.97 91.44,35.56 88.9,38.1 JP5.18
N$69
  Bottom 0.61: IC6.11 90.17,10.16 92.71,12.7 92.71,38.1 90.17,40.64 JP5.16
N$70  (via drill 1 pad 0.81)
  Top 0.61: R5.P$2 41.91,19.05 v33.02,12.7
  Bottom 0.305: U1.28 28.09,50.7 35.1,50.7 43.33,42.47 43.33,25.4 42.11,24.18 R5.P$2
  Bottom 0.406: IC8.6 29.21,7.62 v33.02,12.7
N$71
  Bottom 0.305: 26.87,6.2 25.65,7.42 20.47,7.42 IC8.3
  Bottom 0.406: 31.75,6.35 27.03,6.35 26.87,6.2
  Bottom 0.61: JP2.2 41.83,7.54 39.37,5.08 33.02,5.08 31.75,6.35
N$72
  Bottom 0.305: 21.39,8.94 19.25,8.94 18.34,8.03 18.34,7.11 18.95,6.5 21.39,6.5 22.61,5.28 27.79,5.28 IC8.5 | 37.85,24.18 R4.P$2 | 30.23,26.62 26.87,26.62 25.96,27.53 25.96,31.75 25.96,46.43 27.79,48.26 U1.27
  Bottom 0.406: 30.23,26.62 31.7,26.62 34.29,29.21 36.83,29.21 38.1,27.94 R4.P$2
  Bottom 0.61: 21.39,8.94 22.91,8.94 24.13,10.16 24.13,29.92 25.96,31.75
N$73
  Bottom 0.61: Q2.2 13.97,11.43 15.24,12.7 IC8.1
N$74
  Bottom 0.305: IC8.2 19.56,10.16
  Bottom 0.61: Q2.1 16.51,8.89 17.78,10.16 IC8.2

### Text on the board
tPlace: - | + | Power | TimeSet | Pulse | 3.3V
_tNames: IC5 | JP6 | IC1 | D1 | C5 | R3 | R1 | C6 | JP5 | IC7 | LED2 | C4 | IC4 | S1 | U1 | IC2 | C3 | JP1 | JP3 | Q1 | C1 | R4 | R5 | IC6 | C2 | IC3 | R2 | LED1 | Q2 | IC8 | JP2 | JP4